# Altium project BMS.PrjPcb (part 1 of 2)
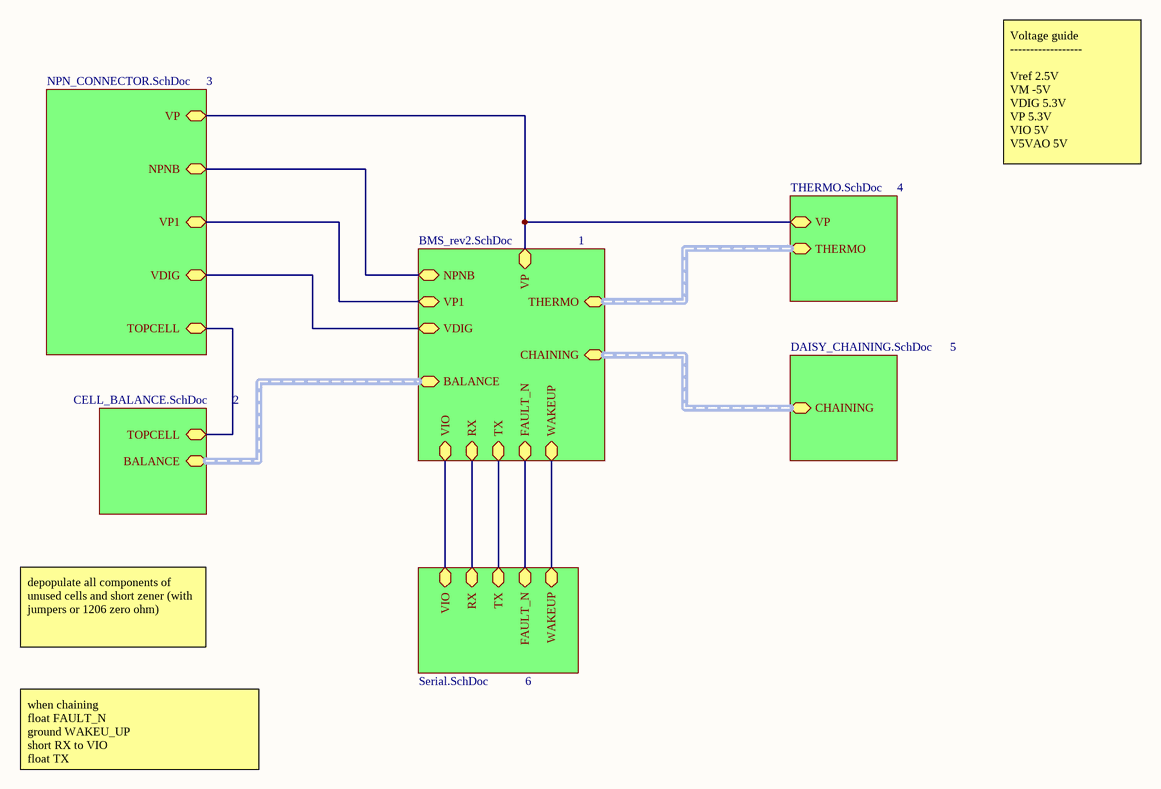
[diagram p0: BMS.SchDoc]
8 sheets, 234 parts. Net scope: hierarchical (ports join the sheet entries above them; power ports are global).
Board file: PCB_REV1.PcbDoc
Sheets:
  BMS.SchDoc
    1 = BMS_rev2.SchDoc
    2 = CELL_BALANCE.SchDoc
      4 = VSENSE_EQ.SchDoc
      3 = VSENSE_EQ.SchDoc
      2 = VSENSE_EQ.SchDoc
      1 = VSENSE_EQ.SchDoc
      5 = VSENSE_EQ.SchDoc
      6 = VSENSE_EQ.SchDoc
      7 = VSENSE_EQ.SchDoc
      8 = VSENSE_EQ.SchDoc
      12 = VSENSE_EQ.SchDoc
      11 = VSENSE_EQ.SchDoc
      10 = VSENSE_EQ.SchDoc
      9 = VSENSE_EQ.SchDoc
      13 = VSENSE_EQ.SchDoc
      14 = VSENSE_EQ.SchDoc
      15 = VSENSE_EQ.SchDoc
      16 = VSENSE_EQ.SchDoc
    5 = DAISY_CHAINING.SchDoc
    4 = THERMO.SchDoc
    3 = NPN_CONNECTOR.SchDoc
    6 = Serial.SchDoc

## Sheet BMS.SchDoc: BMS - AFE
size A4; DrawnBy: Jarod Krane; SheetNumber: 1; SheetTotal: 8

### Sub-sheets
1 = BMS_rev2.SchDoc: NPNB, VP, BALANCE (harness balance), THERMO, CHAINING, VDIG, VP1, VIO, RX, TX, FAULT_N, WAKEUP
2 = CELL_BALANCE.SchDoc: BALANCE, TOPCELL
3 = NPN_CONNECTOR.SchDoc: TOPCELL, NPNB, VP, VDIG, VP1
4 = THERMO.SchDoc: THERMO (harness thermo), VP
5 = DAISY_CHAINING.SchDoc: CHAINING (harness chaining)
6 = Serial.SchDoc: VIO, RX, TX, FAULT_N, WAKEUP

### Nets
FAULT_N: sheet 1/FAULT_N, sheet 6/FAULT_N
NPNB: sheet 1/NPNB, sheet 3/NPNB
RX: sheet 1/RX, sheet 6/RX
TOPCELL: sheet 2/TOPCELL, sheet 3/TOPCELL
TX: sheet 1/TX, sheet 6/TX
VDIG: sheet 1/VDIG, sheet 3/VDIG
VIO: sheet 1/VP1, sheet 1/VIO, sheet 3/VP1, sheet 6/VIO
VP: sheet 1/VP, sheet 4/VP, sheet 3/VP
WAKEUP: sheet 1/WAKEUP, sheet 6/WAKEUP

### Buses and harness runs
harness sheet 1/BALANCE = sheet 2/BALANCE
harness sheet 1/CHAINING = sheet 5/CHAINING
harness sheet 1/THERMO = sheet 4/THERMO

### Notes on the sheet
- Voltage guide
  ------------------
  Vref	2.5V
  VM	-5V
  VDIG	5.3V
  VP	5.3V
  VIO	5V
  V5VAO	5V
- depopulate all components of unused cells and short zener (with jumpers or 1206 zero ohm)
- when chaining
  float FAULT_N
  ground WAKEU_UP
  short RX to VIO
  float TX
  populate resistor connecting VIO to VP

## Sheet BMS_rev2.SchDoc: BMS - AFE
size A4; DrawnBy: Jarod Krane; SheetTotal: 8
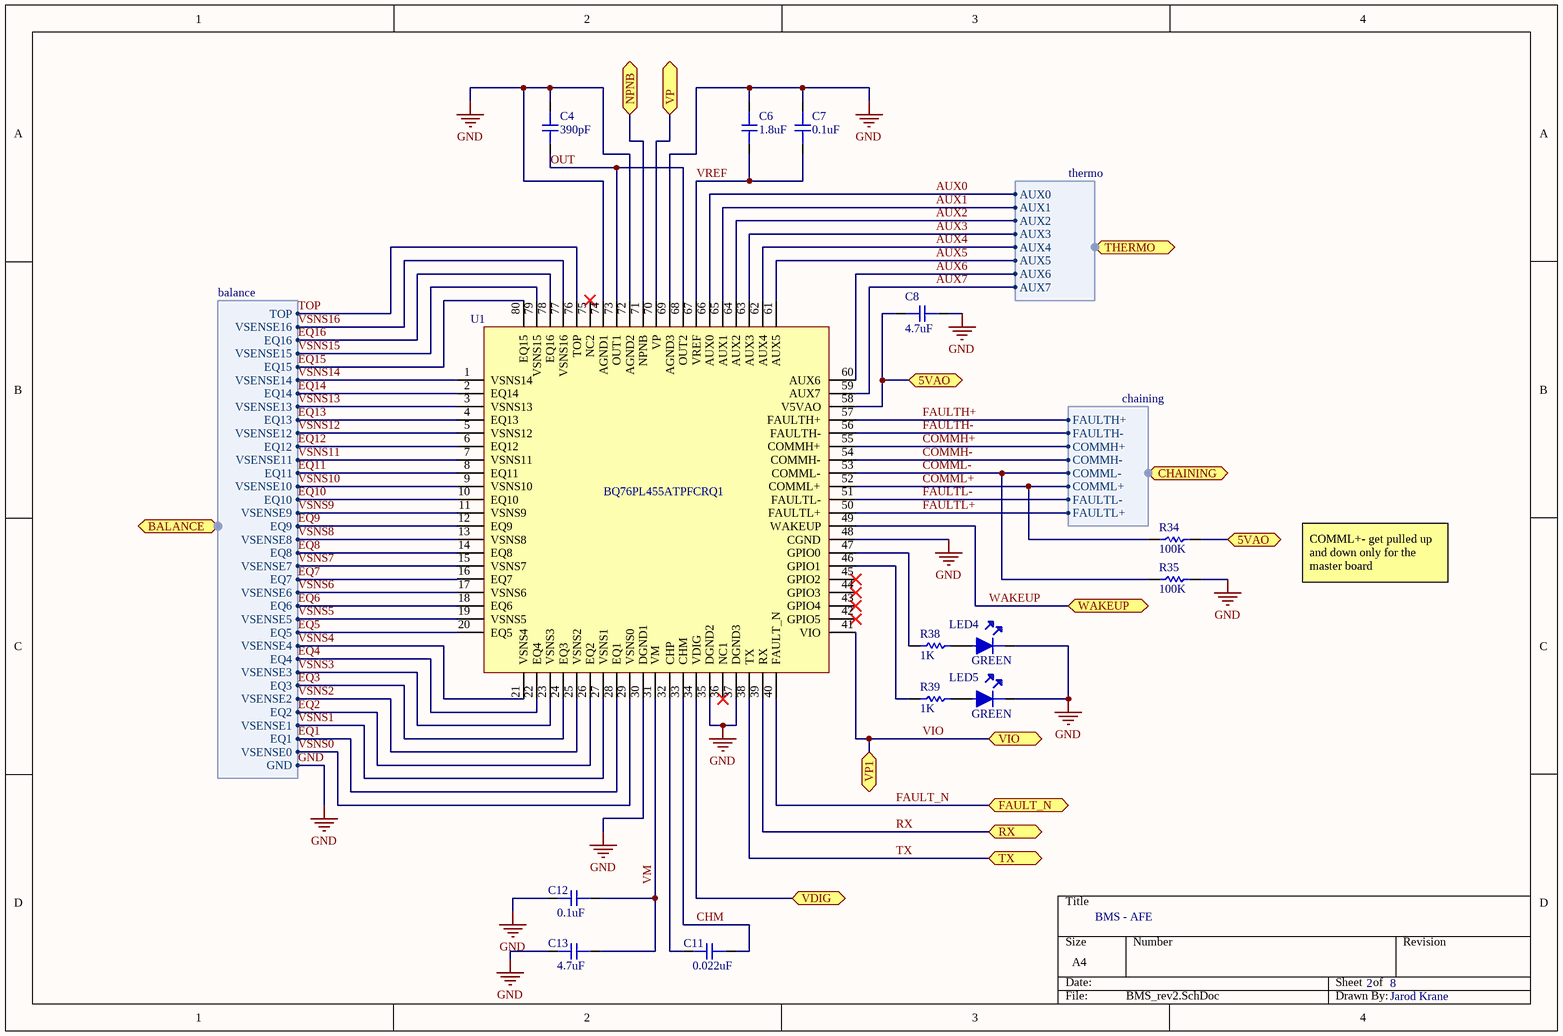
[diagram p1: BMS_rev2.SchDoc]

### Parts
C4  390pF  [0805 CAP]
C6  1.8uF  [1210 cap]
C7  0.1uF  [0603 CAP - duplicate]
C8  4.7uF  [0805 CAP]
C11  0.022uF  [0603 CAP - duplicate]
C12  0.1uF  [0603 CAP - duplicate]
C13  4.7uF  [0805 CAP]
LED4  GREEN  [LED2]
LED5  GREEN  [LED2]
R34  100K  [0603 RES]
R35  100K  [0603 RES]
R38  1K  [0603 RES]
R39  1K  [0603 RES]
U1  BQ76PL455ATPFCRQ1  [BQ76PL455A-Q1]

### Ports
5VAO, BALANCE (harness balance), CHAINING (harness chaining), FAULT_N, NPNB, RX, THERMO (harness thermo), TX, VDIG, VIO, VP, VP1, WAKEUP

### Harnesses
balance: TOP, VSENSE16, EQ16, VSENSE15, VSENSE13, EQ13, VSENSE12, EQ12, VSENSE11, EQ11, VSENSE10, EQ10, VSENSE9, EQ9, VSENSE8, EQ8, VSENSE7, EQ7, VSENSE6, EQ6, VSENSE5, EQ5, VSENSE4, EQ4, VSENSE3, EQ3, VSENSE2, EQ15, VSENSE14, EQ14, EQ2, VSENSE1, EQ1, VSENSE0, GND
chaining: FAULTH+, FAULTH-, COMMH+, COMMH-, COMML-, COMML+, FAULTL-, FAULTL+
thermo: AUX0, AUX1, AUX2, AUX3, AUX4, AUX5, AUX6, AUX7

### Nets
GND: C4.2 C6.2 C7.2 C8.2 C12.1 C13.1 LED4.2 LED5.2 R35.2 U1.30(DGND1) U1.35(DGND2) U1.37(DGND3) U1.48(CGND) U1.69(AGND3) U1.72(AGND2) U1.74(AGND1) ; port BALANCE.GND
AUX0: U1.66(AUX0) ; port THERMO.AUX0
AUX1: U1.65(AUX1) ; port THERMO.AUX1
AUX2: U1.64(AUX2) ; port THERMO.AUX2
AUX3: U1.63(AUX3) ; port THERMO.AUX3
AUX4: U1.62(AUX4) ; port THERMO.AUX4
AUX5: U1.61(AUX5) ; port THERMO.AUX5
AUX6: U1.60(AUX6) ; port THERMO.AUX6
AUX7: U1.59(AUX7) ; port THERMO.AUX7
CHM: C11.2 U1.33(CHM)
COMMH+: U1.55(COMMH+) ; port CHAINING.COMMH+
COMMH-: U1.54(COMMH-) ; port CHAINING.COMMH-
COMML+: R34.1 U1.52(COMML+) ; port CHAINING.COMML+
COMML-: R35.1 U1.53(COMML-) ; port CHAINING.COMML-
EQ1: U1.28(EQ1) ; port BALANCE.EQ1
EQ2: U1.26(EQ2) ; port BALANCE.EQ2
EQ3: U1.24(EQ3) ; port BALANCE.EQ3
EQ4: U1.22(EQ4) ; port BALANCE.EQ4
EQ5: U1.20(EQ5) ; port BALANCE.EQ5
EQ6: U1.18(EQ6) ; port BALANCE.EQ6
EQ7: U1.16(EQ7) ; port BALANCE.EQ7
EQ8: U1.14(EQ8) ; port BALANCE.EQ8
EQ9: U1.12(EQ9) ; port BALANCE.EQ9
EQ10: U1.10(EQ10) ; port BALANCE.EQ10
EQ11: U1.8(EQ11) ; port BALANCE.EQ11
EQ12: U1.6(EQ12) ; port BALANCE.EQ12
EQ13: U1.4(EQ13) ; port BALANCE.EQ13
EQ14: U1.2(EQ14) ; port BALANCE.EQ14
EQ15: U1.80(EQ15) ; port BALANCE.EQ15
EQ16: U1.78(EQ16) ; port BALANCE.EQ16
FAULT_N: U1.40(FAULT_N) ; port FAULT_N
FAULTH+: U1.57(FAULTH+) ; port CHAINING.FAULTH+
FAULTH-: U1.56(FAULTH-) ; port CHAINING.FAULTH-
FAULTL+: U1.50(FAULTL+) ; port CHAINING.FAULTL+
FAULTL-: U1.51(FAULTL-) ; port CHAINING.FAULTL-
NPNB: U1.71(NPNB) ; port NPNB
OUT: C4.1 U1.68(OUT2) U1.73(OUT1)
RX: U1.39(RX) ; port RX
TOP: U1.76(TOP) ; port BALANCE.TOP
TX: U1.38(TX) ; port TX
VDIG: U1.34(VDIG) ; port VDIG
VIO: U1.41(VIO) ; port VP1, port VIO
VM: C12.2 C13.2 U1.31(VM)
VP: U1.70(VP) ; port VP
VREF: C6.1 C7.1 U1.67(VREF)
VSNS0: U1.29(VSNS0) ; port BALANCE.VSENSE0
VSNS1: U1.27(VSNS1) ; port BALANCE.VSENSE1
VSNS2: U1.25(VSNS2) ; port BALANCE.VSENSE2
VSNS3: U1.23(VSNS3) ; port BALANCE.VSENSE3
VSNS4: U1.21(VSNS4) ; port BALANCE.VSENSE4
VSNS5: U1.19(VSNS5) ; port BALANCE.VSENSE5
VSNS6: U1.17(VSNS6) ; port BALANCE.VSENSE6
VSNS7: U1.15(VSNS7) ; port BALANCE.VSENSE7
VSNS8: U1.13(VSNS8) ; port BALANCE.VSENSE8
VSNS9: U1.11(VSNS9) ; port BALANCE.VSENSE9
VSNS10: U1.9(VSNS10) ; port BALANCE.VSENSE10
VSNS11: U1.7(VSNS11) ; port BALANCE.VSENSE11
VSNS12: U1.5(VSNS12) ; port BALANCE.VSENSE12
VSNS13: U1.3(VSNS13) ; port BALANCE.VSENSE13
VSNS14: U1.1(VSNS14) ; port BALANCE.VSENSE14
VSNS15: U1.79(VSNS15) ; port BALANCE.VSENSE15
VSNS16: U1.77(VSNS16) ; port BALANCE.VSENSE16
WAKEUP: U1.49(WAKEUP) ; port WAKEUP
NetC8_1: C8.1 R34.2 U1.58(V5VAO) ; port 5VAO
NetC11_1: C11.1 U1.32(CHP)
NetLED4_1: LED4.1 R38.2
NetLED5_1: LED5.1 R39.2
NetR38_1: R38.1 U1.47(GPIO0)
NetR39_1: R39.1 U1.46(GPIO1)

Not connected (* = marked no-connect by the designer): U1 36(NC1)* 42(GPIO5)* 43(GPIO4)* 44(GPIO3)* 45(GPIO2)* 75(NC2)*

### Notes on the sheet
- COMML+- get pulled up and down only for the master board
- 2

### Library data of the parts
C4 = 08055A391JAT2A: CAP CER 390PF 50V C0G/NP0 0805; Manufacturer: Kyocera AVX; Dielectric Material: Ceramic; Tolerance: 5%; Dielectric: C0G; Temperature Coefficient: 30ppm/°C; Supplier 1: Digi-Key; Manufacturer Part Number: 08055A391JAT2A; Stock 1: 18; Pricing 1: 1=0.22, 10=0.16, 100=0.075, 500=0.0526, 1000=0.0436 (USD); Mount: PCB,Surface Mount; Case/Package: 0805; Number of Pins: 2; Case Code (Imperial): 0805; Case Code (Metric): 2012; Contact Plating: Matte,Tin; Min Operating Temperature: -55°C; Max Operating Temperature: 125°C; Packaging: Tape and Reel; Capacitance: 390pF; Package Quantity: 1; Voltage Rating: 50V; Voltage Rating (DC): 50V; Termination: SMD/SMT; Voltage: 50V; Length: 2.01mm; Height: 0.94mm; Width: 1.25mm; Thickness: 0.037inch; Depth: 1.25mm; Radiation Hardening: No; REACH SVHC: No SVHC; Lead Free: Lead Free; Supplier Part Number 1: 478-1323-1-ND
C6 = C1210C185K3RACTU: CAP CER 1.8UF 25V X7R 1210; Manufacturer: KEMET; Dielectric Material: Ceramic; Tolerance: 10%; Dissipation Factor: 3.5%; Supplier 1: Digi-Key; Manufacturer Part Number: C1210C185K3RACTU; Stock 1: 3636; Pricing 1: 1=1.15, 10=0.876, 100=0.6267, 500=0.4852, 1000=0.4178 (USD); Mount: PCB,Surface Mount; Case/Package: 1210; Case Code (Metric): 3225; Case Code (Imperial): 1210; Min Operating Temperature: -55°C; Max Operating Temperature: 125°C; Package Quantity: 1; Capacitance: 1.8uF; Voltage Rating: 25V; Packaging: Tape and Reel; Voltage Rating (DC): 25V; Dielectric: X7R; Termination: SMD/SMT; Voltage: 25V; Length: 3.2mm; Height: 1.55mm; Width: 0.098inch; Thickness: 0.067inch; Depth: 2.5mm; REACH SVHC: No SVHC; Supplier Part Number 1: 399-3082-1-ND
C7 C12 = 06035C104KAZ2A: CAP CER 0.1UF 50V X7R 0603; Manufacturer: Kyocera AVX; Capacitance: 100nF; Tolerance: 10%; Temperature Coefficient: 30ppm/°C; Supplier 1: Digi-Key; Manufacturer Part Number: 06035C104KAZ2A; Stock 1: 40000; Pricing 1: 1=0.23, 10=0.161, 100=0.0756, 500=0.053, 1000=0.0439 (USD); Mount: PCB,Surface Mount; Case/Package: 0603; Number of Pins: 2; Case Code (Metric): 1608; Case Code (Imperial): 0603; Contact Plating: Matte,Tin; Min Operating Temperature: -55°C; Max Operating Temperature: 125°C; Package Quantity: 1; Voltage Rating: 50V; Packaging: Tape and Reel; Voltage Rating (DC): 50V; Dielectric: X7R; Termination: SMD/SMT; Voltage: 50V; Features: Soft Termination; Length: 1.6mm; Height: 0.94mm; Width: 0.032inch; Thickness: 0.035inch; Depth: 0.81mm; Radiation Hardening: No; REACH SVHC: No SVHC; Lead Free: Lead Free; Supplier Part Number 1: 478-3540-1-ND
C8 C13 = CL21B475KOFNFNE: CAP CER 4.7UF 16V X7R 0805; Manufacturer: Samsung; Tolerance: 10%; Supplier 1: Digi-Key; Manufacturer Part Number: CL21B475KOFNFNE; Stock 1: 20000; Pricing 1: 1=0.3, 10=0.208, 100=0.1181, 500=0.0833, 1000=0.0729 (USD); Mount: Surface Mount; Case/Package: 0805; Case Code (Metric): 2012; Case Code (Imperial): 0805; Min Operating Temperature: -55°C; Max Operating Temperature: 125°C; Package Quantity: 1; Packaging: Tape and Reel; Capacitance: 4.7uF; Voltage Rating: 16V; Dielectric: X7R; Length: 0.079inch; Height: 1.25mm; Width: 0.049inch; Thickness: 0.053inch; Depth: 1.25mm; Radiation Hardening: No; Supplier Part Number 1: 1276-2970-1-ND
C11 = C1608X7R1H223K080AA: CAP CER 0.022UF 50V X7R 0603; Manufacturer: TDK; Dielectric Material: Ceramic; Capacitance: 22nF; Tolerance: 10%; Supplier 1: Digi-Key; Manufacturer Part Number: C1608X7R1H223K080AA; Stock 1: 3; Pricing 1: 1=0.1, 10=0.074, 100=0.0331, 500=0.0237, 1000=0.0186 (USD); Mount: Surface Mount; Case/Package: 0603; Number of Pins: 2; Weight: 7.1E-05oz; Case Code (Metric): 1608; Case Code (Imperial): 0603; Min Operating Temperature: -55°C; Max Operating Temperature: 125°C; Package Quantity: 1; Voltage Rating: 50V; Packaging: Tape and Reel; Voltage Rating (DC): 50V; Dielectric: X7R; Termination: SMD/SMT; Composition: Ceramic; Voltage: 50V; Length: 1.6mm; Height: 0.8mm; Width: 0.031inch; Thickness: 0.037inch; Depth: 0.8mm; Radiation Hardening: No; REACH SVHC: No SVHC; Lead Free: Lead Free; Supplier Part Number 1: 445-1312-1-ND
LED4 LED5 = 150060VS75000: LED GREEN CLEAR 0603 SMD; Manufacturer: Wurth Electronics; Luminous Intensity: 40mcd; Viewing Angle: 140°; Forward Voltage: 2V; Wavelength: 570nm; Lens Style: Clear,Rectangular; Forward Current: 30mA; Test Current: 20mA; Supplier 1: Digi-Key; Manufacturer Part Number: 150060VS75000; Stock 1: 219425; Pricing 1: 1=0.14, 50=0.129, 100=0.11, 500=0.095 (USD); Mount: Surface Mount; Case/Package: 0603; Number of Pins: 2; Colour: Green; Case Code (Metric): 1608; Case Code (Imperial): 0603; Min Operating Temperature: -40°C; Max Operating Temperature: 85°C; Package Quantity: 1; Packaging: Tape and Reel; Dominant Wavelength: 570nm; Length: 1.6mm; Height: 0.7mm; Width: 0.8mm; REACH SVHC: Unknown; ComponentLink1URL: http://www.farnell.com/datasheets/1911347.pdf; ComponentLink1Description: http://www.farnell.com/datasheets/1911347.pdf; ComponentLink2URL: https://katalog.we-online.de/led/datasheet/150060VS75000.pdf; ComponentLink2Description: https://katalog.we-online.de/led/datasheet/150060VS75000.pdf; ComponentLink3URL: https://www.distrelec.biz/Web/Downloads/_t/ds/150060VS75000_eng_tds.pdf?mime=application%2Fpdf; ComponentLink3Description: https://www.distrelec.biz/Web/Downloads/_t/ds/150060VS75000_eng_tds.pdf?mime=application%2Fpdf; ComponentLink4URL: http://www.produktinfo.conrad.com/datenblaetter/750000-774999/759431-da-01-en-CHIPLED_0603_W_KL_H_GRUEN_150060VS7500.pdf; ComponentLink4Description: http://www.produktinfo.conrad.com/datenblaetter/750000-774999/759431-da-01-en-CHIPLED_0603_W_KL_H_GRUEN_150060VS7500.pdf; Supplier Part Number 1: 732-4980-1-ND
R34 R35 = ERJ-3EKF1003V: RES SMD 100K OHM 1% 1/10W 0603; Manufacturer: Panasonic; Manufacturer Part Number: ERJ3EKF-1003V; Resistance: 100kR; Power Rating: 100mW; Voltage Rating: 75V; Temperature Coefficient: 100ppm/°C; Supplier 1: Digi-Key; Stock 1: 10349154; Pricing 1: 1=0.1, 10=0.064, 100=0.0261, 1000=0.0117, 2500=0.0102 (USD); Case/Package: 0603; Number of Pins: 2; Case Code (Metric): 1608; Case Code (Imperial): 0603; Contact Plating: Tin; Min Operating Temperature: -55°C; Max Operating Temperature: 155°C; Tolerance: 1%; Packaging: Tape and Reel; Composition: Thick Film; Military Standard: Not; Voltage Rating (DC): 75V; Length: 1.6mm; Depth: 0.8mm; Width: 800um; Radiation Hardening: No; REACH SVHC: No SVHC; Lead Free: Lead Free; Supplier Part Number 1: P100KHCT-ND; Supplier 2: Digi-Key; Stock 2: 4435882; Pricing 2: 1=0.1, 10=0.024, 100=0.0097, 1000=0.0044, 2500=0.0038 (USD); Mount: Surface Mount; Package Quantity: 1; Number of Terminations: 2; Termination: SMD/SMT; Max Power Dissipation: 100mW; Features: Moisture Resistant; Height: 0.022inch; ComponentLink1URL: https://www.verical.com/server-webapp/html/getDatasheet?partID=323805&src-supplier=Verical; ComponentLink1Description: https://www.verical.com/server-webapp/html/getDatasheet?partID=323805&src-supplier=Verical; ComponentLink2URL: http://www.yageo.com/documents/recent/PYu-RC_Group_51_RoHS_L_10.pdf?src-supplier=Digi-Key; ComponentLink2Description: http://www.yageo.com/documents/recent/PYu-RC_Group_51_RoHS_L_10.pdf?src-supplier=Digi-Key; ComponentLink3URL: http://www.yageo.com/documents/recent/PYu-RC_Group_51_RoHS_L_9.pdf?src-supplier=Digi-Key; ComponentLink3Description: http://www.yageo.com/documents/recent/PYu-RC_Group_51_RoHS_L_9.pdf?src-supplier=Digi-Key; Supplier Part Number 2: 311-49.9KHRCT-ND
R38 R39 = CRCW06031K00FKEA: RES SMD 1K OHM 1% 1/10W 0603; Manufacturer: Vishay Dale; Resistance: 1kR; Power Rating: 100mW; Voltage Rating: 75V; Temperature Coefficient: 100ppm/°C; Supplier 1: Digi-Key; Manufacturer Part Number: CRCW06031K00FKEA; Stock 1: 3823619; Pricing 1: 1=0.1, 10=0.042, 100=0.017, 1000=0.0076, 2500=0.0066 (USD); Mount: Surface Mount; Case/Package: 0603; Number of Pins: 2; Weight: 7.1E-05oz; Case Code (Metric): 1608; Case Code (Imperial): 0603; Contact Plating: Tin; Min Operating Temperature: -55°C; Max Operating Temperature: 155°C; Composition: Thick Film; Tolerance: 1%; Packaging: Tape and Reel; Package Quantity: 10; Number of Terminations: 2; Termination: SMD/SMT; Military Standard: Not; Max Power Dissipation: 100mW; Voltage Rating (DC): 75V; Features: Automotive AEC-Q200; Length: 1.55mm; Height: 0.45mm; Width: 0.033inch; Depth: 0.85mm; Radiation Hardening: No; REACH SVHC: Unknown; Lead Free: Lead Free; Supplier Part Number 1: 541-1.00KHCT-ND
U1 = BQ76PL455ATPFCRQ1: IC BATT MONITOR/PROTECT 80TQFP; Manufacturer: Texas Instruments; Interface: UART; Fault Protection: Over/Under Voltage; Operating Supply Voltage: 22V; Supplier 1: Digi-Key; Manufacturer Part Number: BQ76PL455ATPFCRQ1; Stock 1: 0; Pricing 1: 1=19.03, 10=17.486, 100=14.7676, 500=13.1368 (USD); Mount: Surface Mount; Case/Package: TQFP; Number of Pins: 80; Min Operating Temperature: -40°C; Max Operating Temperature: 105°C; Packaging: Tape and Reel; Lead Free: Lead Free; Supplier Part Number 1: 296-44049-1-ND

## Sheet CELL_BALANCE.SchDoc: BMS - AFE
size A4; DrawnBy: Jarod Krane; SheetNumber: 3; SheetTotal: 8
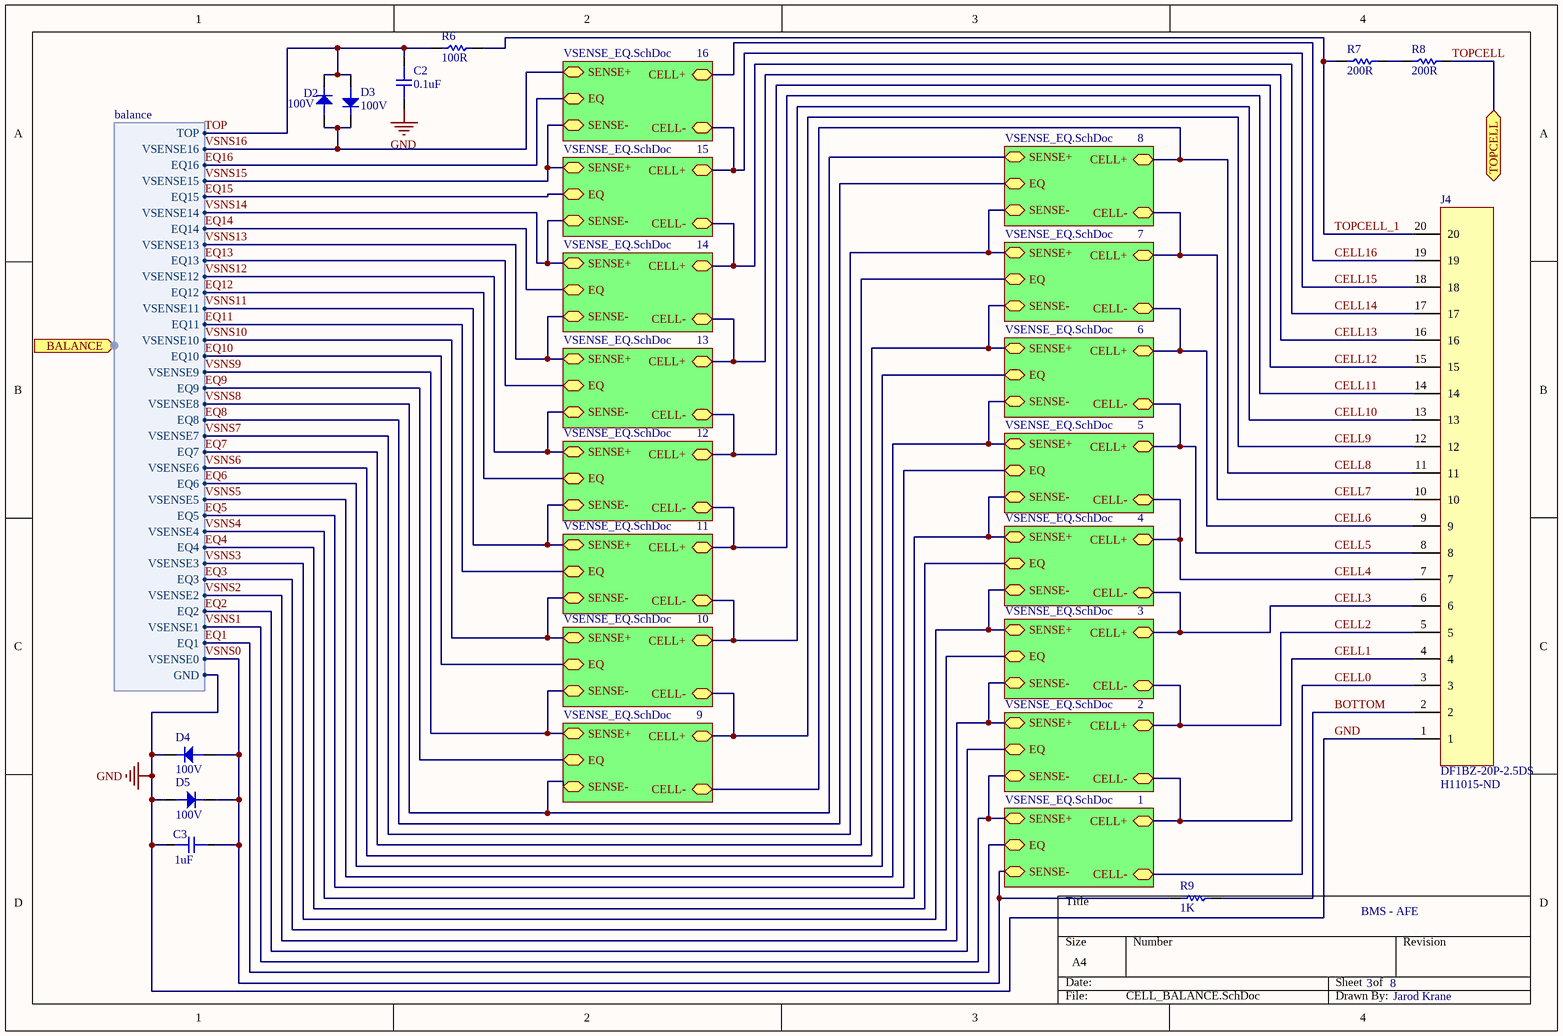
[diagram p2: CELL_BALANCE.SchDoc]

### Parts
C2  0.1uF  [1210 cap]
C3  1uF  [0603 CAP - duplicate]
D2  100V  [DIODE BtoB]
D3  100V  [DIODE BtoB]
D4  100V  [DIODE BtoB]
D5  100V  [DIODE BtoB]
J4  DF1BZ-20P-2.5DS  Supplier Part Number 1: H11015-ND  [PCBComponent_1]
R6  100R  [1206 RES]
R7  200R  [2512 RES]
R8  200R  [2512 RES]
R9  1K  [0603 RES]

### Sub-sheets
1 = VSENSE_EQ.SchDoc: SENSE+, CELL+, SENSE-, CELL-, EQ
2 = VSENSE_EQ.SchDoc: SENSE+, CELL+, SENSE-, CELL-, EQ
3 = VSENSE_EQ.SchDoc: SENSE+, CELL+, SENSE-, CELL-, EQ
4 = VSENSE_EQ.SchDoc: SENSE+, CELL+, SENSE-, CELL-, EQ
5 = VSENSE_EQ.SchDoc: SENSE+, CELL+, SENSE-, CELL-, EQ
6 = VSENSE_EQ.SchDoc: SENSE+, CELL+, SENSE-, CELL-, EQ
7 = VSENSE_EQ.SchDoc: SENSE+, CELL+, SENSE-, CELL-, EQ
8 = VSENSE_EQ.SchDoc: SENSE+, CELL+, SENSE-, CELL-, EQ
9 = VSENSE_EQ.SchDoc: SENSE+, CELL+, SENSE-, CELL-, EQ
10 = VSENSE_EQ.SchDoc: SENSE+, CELL+, SENSE-, CELL-, EQ
11 = VSENSE_EQ.SchDoc: SENSE+, CELL+, SENSE-, CELL-, EQ
12 = VSENSE_EQ.SchDoc: SENSE+, CELL+, SENSE-, CELL-, EQ
13 = VSENSE_EQ.SchDoc: SENSE+, CELL+, SENSE-, CELL-, EQ
14 = VSENSE_EQ.SchDoc: SENSE+, CELL+, SENSE-, CELL-, EQ
15 = VSENSE_EQ.SchDoc: SENSE+, CELL+, SENSE-, CELL-, EQ
16 = VSENSE_EQ.SchDoc: SENSE+, CELL+, SENSE-, CELL-, EQ

### Ports
BALANCE (harness balance), TOPCELL

### Harnesses
balance: GND, VSENSE0, EQ1, VSENSE1, EQ2, VSENSE2, EQ3, VSENSE3, EQ4, VSENSE4, EQ5, VSENSE5, EQ6, VSENSE6, EQ7, VSENSE7, EQ8, VSENSE8, EQ9, VSENSE9, EQ10, VSENSE10, EQ11, VSENSE11, EQ12, VSENSE12, EQ13, VSENSE13, EQ14, VSENSE14, EQ15, VSENSE15, EQ16, VSENSE16, TOP

### Nets
GND: C2.1 C3.1 D4.2 D5.1 J4.1 ; port BALANCE.GND
BOTTOM: J4.2 R9.2
CELL0: J4.3 ; sheet 1/CELL-
CELL1: J4.4 ; sheet 2/CELL-, sheet 1/CELL+
CELL2: J4.5 ; sheet 3/CELL-, sheet 2/CELL+
CELL3: J4.6 ; sheet 4/CELL-, sheet 3/CELL+
CELL4: J4.7 ; sheet 4/CELL+, sheet 5/CELL-
CELL5: J4.8 ; sheet 5/CELL+, sheet 6/CELL-
CELL6: J4.9 ; sheet 6/CELL+, sheet 7/CELL-
CELL7: J4.10 ; sheet 7/CELL+, sheet 8/CELL-
CELL8: J4.11 ; sheet 8/CELL+, sheet 9/CELL-
CELL9: J4.12 ; sheet 10/CELL-, sheet 9/CELL+
CELL10: J4.13 ; sheet 11/CELL-, sheet 10/CELL+
CELL11: J4.14 ; sheet 12/CELL-, sheet 11/CELL+
CELL12: J4.15 ; sheet 12/CELL+, sheet 13/CELL-
CELL13: J4.16 ; sheet 13/CELL+, sheet 14/CELL-
CELL14: J4.17 ; sheet 14/CELL+, sheet 15/CELL-
CELL15: J4.18 ; sheet 15/CELL+, sheet 16/CELL-
CELL16: J4.19 ; sheet 16/CELL+
EQ1: sheet 1/EQ, port BALANCE.EQ1
EQ2: sheet 2/EQ, port BALANCE.EQ2
EQ3: sheet 3/EQ, port BALANCE.EQ3
EQ4: sheet 4/EQ, port BALANCE.EQ4
EQ5: sheet 5/EQ, port BALANCE.EQ5
EQ6: sheet 6/EQ, port BALANCE.EQ6
EQ7: sheet 7/EQ, port BALANCE.EQ7
EQ8: sheet 8/EQ, port BALANCE.EQ8
EQ9: sheet 9/EQ, port BALANCE.EQ9
EQ10: sheet 10/EQ, port BALANCE.EQ10
EQ11: sheet 11/EQ, port BALANCE.EQ11
EQ12: sheet 12/EQ, port BALANCE.EQ12
EQ13: sheet 13/EQ, port BALANCE.EQ13
EQ14: sheet 14/EQ, port BALANCE.EQ14
EQ15: sheet 15/EQ, port BALANCE.EQ15
EQ16: sheet 16/EQ, port BALANCE.EQ16
TOP: C2.2 D2.2 D3.1 R6.1 ; port BALANCE.TOP
TOPCELL: R8.2 ; port TOPCELL
TOPCELL_1: J4.20 R6.2 R7.1
VSNS0: C3.2 D4.1 D5.2 R9.1 ; sheet 1/SENSE-, port BALANCE.VSENSE0
VSNS1: sheet 2/SENSE-, sheet 1/SENSE+, port BALANCE.VSENSE1
VSNS2: sheet 3/SENSE-, sheet 2/SENSE+, port BALANCE.VSENSE2
VSNS3: sheet 4/SENSE-, sheet 3/SENSE+, port BALANCE.VSENSE3
VSNS4: sheet 4/SENSE+, sheet 5/SENSE-, port BALANCE.VSENSE4
VSNS5: sheet 5/SENSE+, sheet 6/SENSE-, port BALANCE.VSENSE5
VSNS6: sheet 6/SENSE+, sheet 7/SENSE-, port BALANCE.VSENSE6
VSNS7: sheet 7/SENSE+, sheet 8/SENSE-, port BALANCE.VSENSE7
VSNS8: sheet 8/SENSE+, sheet 9/SENSE-, port BALANCE.VSENSE8
VSNS9: sheet 10/SENSE-, sheet 9/SENSE+, port BALANCE.VSENSE9
VSNS10: sheet 11/SENSE-, sheet 10/SENSE+, port BALANCE.VSENSE10
VSNS11: sheet 12/SENSE-, sheet 11/SENSE+, port BALANCE.VSENSE11
VSNS12: sheet 12/SENSE+, sheet 13/SENSE-, port BALANCE.VSENSE12
VSNS13: sheet 13/SENSE+, sheet 14/SENSE-, port BALANCE.VSENSE13
VSNS14: sheet 14/SENSE+, sheet 15/SENSE-, port BALANCE.VSENSE14
VSNS15: sheet 15/SENSE+, sheet 16/SENSE-, port BALANCE.VSENSE15
VSNS16: D2.1 D3.2 ; sheet 16/SENSE+, port BALANCE.VSENSE16
NetR7_2: R7.2 R8.1

### Library data of the parts
C2 = C1210C104KARACTU: CAP CER 0.1UF 250V X7R 1210; Manufacturer: KEMET; Dielectric Material: Ceramic; Capacitance: 100nF; Tolerance: 10%; Dissipation Factor: 2.5%; Supplier 1: Digi-Key; Manufacturer Part Number: C1210C104KARACTU; Stock 1: 3355; Pricing 1: 1=0.68, 10=0.479, 100=0.3156, 500=0.2338, 1000=0.1987 (USD); Mount: PCB,Surface Mount; Case/Package: 1210; Number of Pins: 2; Case Code (Imperial): 1210; Case Code (Metric): 3225; Min Operating Temperature: -55°C; Max Operating Temperature: 125°C; Voltage Rating (DC): 250V; Voltage Rating: 250V; Packaging: Tape and Reel; Package Quantity: 1; Dielectric: X7R; Termination: SMD/SMT; Voltage: 250V; Length: 3.2mm; Height: 1.5mm; Width: 2.5mm; Thickness: 0.055inch; Depth: 2.5mm; REACH SVHC: No SVHC; Supplier Part Number 1: 399-4676-1-ND
C3 = C1608X7R1C105K080AC: CAP CER 1UF 16V X7R 0603; Manufacturer: TDK; Dielectric Material: Ceramic; Tolerance: 10%; Supplier 1: Digi-Key; Manufacturer Part Number: C1608X7R1C105K080AC; Stock 1: 0; Pricing 1: 1=0.12, 10=0.087, 100=0.0387, 500=0.0277, 1000=0.0217 (USD); Mount: Surface Mount; Case/Package: 0603; Weight: 7.1E-05oz; Case Code (Metric): 1608; Case Code (Imperial): 0603; Min Operating Temperature: -55°C; Max Operating Temperature: 125°C; Packaging: Tape and Reel; Package Quantity: 1; Capacitance: 1uF; Voltage Rating: 16V; Voltage Rating (DC): 16V; Dielectric: X7R; Termination: SMD/SMT; Composition: Ceramic; Voltage: 16V; Length: 1.6mm; Height: 0.8mm; Width: 0.031inch; Thickness: 0.037inch; Depth: 0.8mm; Radiation Hardening: No; REACH SVHC: No SVHC; Lead Free: Lead Free; Supplier Part Number 1: 445-1604-1-ND
D2-D5 = 1N4148W-7-F: DIODE GEN PURP 100V 300MA SOD123; Manufacturer: Diodes; Max Surge Current: 2A; Forward Current: 150mA; Peak Reverse Current: 1uA; Recovery Time: 4ns; Forward Voltage: 1.25V; Power Dissipation: 400mW; Element Configuration: Single; Polarity: Standard; Voltage Rating (DC): 75V; Capacitance: 2pF; Current: 15A; Supplier 1: Digi-Key; Manufacturer Part Number: 1N4148W-7-F; Stock 1: 0; Pricing 1: 1=0.18, 10=0.164, 100=0.0891, 500=0.0548, 1000=0.0374 (USD); Mount: Surface Mount; Number of Pins: 2; Weight: 0.000353oz; Contact Plating: Matte,Tin; Min Operating Temperature: -65°C; Max Operating Temperature: 150°C; Package Quantity: 3000; Packaging: Tape and Reel; Average Rectified Current: 300mA; Reverse Recovery Time: 4ns; Max Repetitive Reverse Voltage (Vrrm): 100V; Peak Non-Repetitive Surge Current: 2A; Power Rating: 400mW; Max Reverse Voltage (DC): 100V; Max Forward Surge Current (Ifsm): 2A; Current Rating: 150mA; Output Current: 150mA; Voltage: 100V; Length: 2.85mm; Height: 1.25mm; Width: 1.7mm; Radiation Hardening: No; Lead Free: Lead Free; REACH SVHC: No SVHC; Supplier Part Number 1: 1N4148W-FDICT-ND
J4 = DF1BZ-20P-2.5DS: CONN HEADER 20POS 2.5MM R/A TIN; Manufacturer: Hirose; Number of Positions: 20; Gender: Male; Connector Type: Male Pin; Pitch: 0.098inch; Supplier 1: Digi-Key; Manufacturer Part Number: DF1BZ-20P-2.5DS; Stock 1: 76; Pricing 1: 1=0.87, 10=0.765, 100=0.66, 500=0.54, 1000=0.48 (USD); Mount: Through Hole; Contact Plating: Tin; Colour: White; Housing Colour: White; Package Quantity: 100; Packaging: Bulk; Number of Rows: 1; Termination: Solder; Number of Contacts: 20; Contact Mating Length: 0.177inch; Lead Free: Lead Free
R6 = ERJ-8ENF1000V: RES SMD 100 OHM 1% 1/4W 1206; Manufacturer: Panasonic; Power Rating: 250mW; Voltage Rating: 200V; Temperature Coefficient: 100ppm/°C; Supplier 1: Digi-Key; Manufacturer Part Number: ERJ-8ENF1000V; Stock 1: 474856; Pricing 1: 1=0.11, 10=0.1, 100=0.0385, 1000=0.017, 2500=0.0146 (USD); Mount: Surface Mount; Case/Package: 1206; Number of Pins: 2; Case Code (Metric): 3216; Case Code (Imperial): 1206; Contact Plating: Tin; Min Operating Temperature: -55°C; Max Operating Temperature: 155°C; Resistance: 100R; Tolerance: 1%; Packaging: Tape and Reel; Package Quantity: 1; Composition: Thick Film; Number of Terminations: 2; Termination: SMD/SMT; Military Standard: Not; Max Power Dissipation: 250mW; Voltage Rating (DC): 200V; Features: Automotive AEC-Q200; Working Voltage: 200V; Length: 3.2mm; Height: 0.6mm; Width: 0.063inch; Depth: 1.6mm; Radiation Hardening: No; REACH SVHC: No SVHC; Lead Free: Lead Free; Supplier Part Number 1: P100FCT-ND
R7 R8 = CRCW2512200RJNEG: RES SMD 200 OHM 5% 1W 2512; Manufacturer: Vishay Dale; Voltage Rating: 500V; Temperature Coefficient: 200ppm/°C; Supplier 1: Digi-Key; Manufacturer Part Number: CRCW2512200RJNEG; Stock 1: 0; Pricing 1: 1=0.39, 10=0.333, 100=0.1301, 1000=0.0545 (USD); Mount: Surface Mount; Case/Package: 2512; Number of Pins: 2; Weight: 0.001429oz; Case Code (Metric): 6432; Case Code (Imperial): 2512; Contact Plating: Tin; Min Operating Temperature: -55°C; Max Operating Temperature: 155°C; Resistance: 200R; Tolerance: 5%; Packaging: Tape and Reel; Power Rating: 1W; Package Quantity: 2000; Composition: Thick Film; Number of Terminations: 2; Termination: SMD/SMT; Military Standard: Not; Max Power Dissipation: 1W; Voltage Rating (DC): 500V; Working Voltage: 500V; Features: Automotive AEC-Q200; Length: 6.3mm; Height: 0.6mm; Width: 0.124inch; Depth: 3.15mm; Radiation Hardening: No; REACH SVHC: Unknown; Lead Free: Lead Free; Supplier Part Number 1: 541-200XCT-ND
R9 = CRCW06031K00FKEA: as R38 on sheet BMS_rev2; Supplier 1: Digi-Key; Manufacturer Part Number: CRCW06031K00FKEA; Stock 1: 3823619; Pricing 1: 1=0.1, 10=0.042, 100=0.017, 1000=0.0076, 2500=0.0066 (USD); Mount: Surface Mount; Case/Package: 0603; Number of Pins: 2; Weight: 7.1E-05oz; Case Code (Metric): 1608; Case Code (Imperial): 0603; Contact Plating: Tin; Min Operating Temperature: -55°C; Max Operating Temperature: 155°C; Composition: Thick Film; Tolerance: 1%; Packaging: Tape and Reel; Package Quantity: 10; Number of Terminations: 2; Termination: SMD/SMT; Military Standard: Not; Max Power Dissipation: 100mW; Voltage Rating (DC): 75V; Features: Automotive AEC-Q200; Length: 1.55mm; Height: 0.45mm; Width: 0.033inch; Depth: 0.85mm; Radiation Hardening: No; REACH SVHC: Unknown; Lead Free: Lead Free; Supplier Part Number 1: 541-1.00KHCT-ND

## Sheet VSENSE_EQ.SchDoc: BMS - AFE
size A4; DrawnBy: Jarod Krane; SheetNumber: 4; SheetTotal: 8
Used 16 times, as channels 2/4, 2/3, 2/2, 2/1, 2/5, 2/6, 2/7, 2/8, 2/12, 2/11, 2/10, 2/9, 2/13, 2/14, 2/15, 2/16. Parts and nets are listed once, with the designators drawn on the sheet.
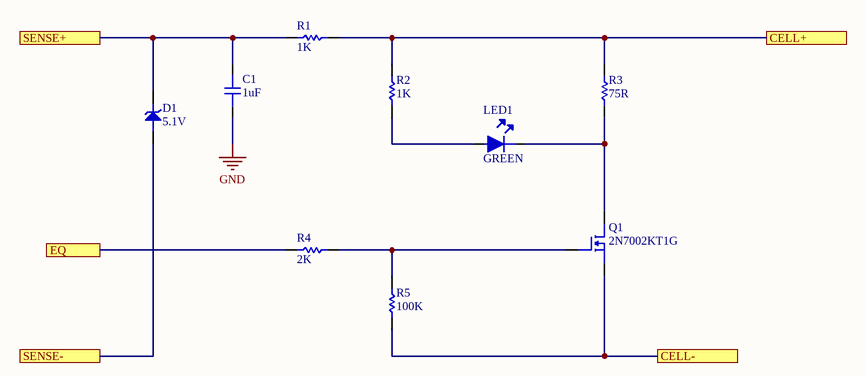
[diagram p3: VSENSE_EQ.SchDoc]

### Parts
C1  1uF  [0805 CAP]
D1  5.1V  [ZENER DIODE]
LED1  GREEN  [LED2]
Q1  2N7002KT1G  [N-MOSFET]
R1  1K  [0603 RES]
R2  1K  [0603 RES]
R3  75R  [2512 RES]
R4  2K  [0603 RES]
R5  100K  [0603 RES]

### Ports
CELL+, CELL-, EQ, SENSE+, SENSE-

### Nets
GND: C1.1
CELL+: R1.2 R2.2 R3.1 ; port CELL+
CELL-: Q1.2 R5.1 ; port CELL-
EQ: R4.1 ; port EQ
SENSE+: C1.2 D1.2 R1.1 ; port SENSE+
SENSE-: D1.1 ; port SENSE-
NetLED1_1: LED1.1 R2.1
NetLED1_2: LED1.2 Q1.3 R3.2
NetQ1_1: Q1.1 R4.2 R5.2

### Channels
2/4: designators end in _1; ports CELL+=CELL4 CELL-=CELL3 EQ=EQ4 SENSE+=VSNS4 SENSE-=VSNS3
2/3: designators end in _2; ports CELL+=CELL3 CELL-=CELL2 EQ=EQ3 SENSE+=VSNS3 SENSE-=VSNS2
2/2: designators end in _3; ports CELL+=CELL2 CELL-=CELL1 EQ=EQ2 SENSE+=VSNS2 SENSE-=VSNS1
2/1: designators end in _4; ports CELL+=CELL1 CELL-=CELL0 EQ=EQ1 SENSE+=VSNS1 SENSE-=VSNS0
2/5: designators end in _5; ports CELL+=CELL5 CELL-=CELL4 EQ=EQ5 SENSE+=VSNS5 SENSE-=VSNS4
2/6: designators end in _6; ports CELL+=CELL6 CELL-=CELL5 EQ=EQ6 SENSE+=VSNS6 SENSE-=VSNS5
2/7: designators end in _7; ports CELL+=CELL7 CELL-=CELL6 EQ=EQ7 SENSE+=VSNS7 SENSE-=VSNS6
2/8: designators end in _8; ports CELL+=CELL8 CELL-=CELL7 EQ=EQ8 SENSE+=VSNS8 SENSE-=VSNS7
2/12: designators end in _9; ports CELL+=CELL12 CELL-=CELL11 EQ=EQ12 SENSE+=VSNS12 SENSE-=VSNS11
2/11: designators end in _10; ports CELL+=CELL11 CELL-=CELL10 EQ=EQ11 SENSE+=VSNS11 SENSE-=VSNS10
2/10: designators end in _11; ports CELL+=CELL10 CELL-=CELL9 EQ=EQ10 SENSE+=VSNS10 SENSE-=VSNS9
2/9: designators end in _12; ports CELL+=CELL9 CELL-=CELL8 EQ=EQ9 SENSE+=VSNS9 SENSE-=VSNS8
2/13: designators end in _13; ports CELL+=CELL13 CELL-=CELL12 EQ=EQ13 SENSE+=VSNS13 SENSE-=VSNS12
2/14: designators end in _14; ports CELL+=CELL14 CELL-=CELL13 EQ=EQ14 SENSE+=VSNS14 SENSE-=VSNS13
2/15: designators end in _15; ports CELL+=CELL15 CELL-=CELL14 EQ=EQ15 SENSE+=VSNS15 SENSE-=VSNS14
2/16: designators end in _16; ports CELL+=CELL16 CELL-=CELL15 EQ=EQ16 SENSE+=VSNS16 SENSE-=VSNS15

### Library data of the parts
C1 = C2012X7S2A105K125AE: CAP CER 1UF 100V X7S 0805; Manufacturer: TDK; Tolerance: 10%; Supplier 1: Digi-Key; Manufacturer Part Number: C2012X7S2A105K125AE; Stock 1: 20000; Pricing 1: 1=0.5, 10=0.356, 100=0.2347, 500=0.1739, 1000=0.1478 (USD); Mount: Surface Mount; Case/Package: 0805; Case Code (Metric): 2012; Case Code (Imperial): 0805; Min Operating Temperature: -55°C; Max Operating Temperature: 125°C; Capacitance: 1uF; Voltage Rating: 100V; Packaging: Tape and Reel; Termination: SMD/SMT; Package Quantity: 1; Voltage Rating (DC): 100V; Dielectric: X7S; Composition: Ceramic; Features: Soft Termination; Length: 2mm; Height: 1.25mm; Width: 0.05inch; Thickness: 0.049inch; Depth: 1.25mm; Lead Free: Lead Free; ComponentLink1URL: https://product.tdk.com/info/en/catalog/spec/mlccspec_commercial_soft_en.pdf; ComponentLink1Description: https://product.tdk.com/info/en/catalog/spec/mlccspec_commercial_soft_en.pdf; ComponentLink2URL: http://www.mouser.com/ds/2/400/lcc_commercial_soft_en-520032.pdf; ComponentLink2Description: http://www.mouser.com/ds/2/400/lcc_commercial_soft_en-520032.pdf; Supplier Part Number 1: 445-8887-1-ND
D1 = MMSZ4689-TP: DIODE ZENER 5.1V 500MW SOD123; Manufacturer: MCC; Tolerance: 5%; Max Reverse Leakage Current: 10uA; Test Current: 50uA; Element Configuration: Single; Supplier 1: Digi-Key; Manufacturer Part Number: MMSZ4689-TP; Stock 1: 294852; Pricing 1: 1=0.22, 10=0.203, 25=0.146, 100=0.1136, 250=0.0714, 500=0.0608, 1000=0.0414 (USD); Mount: Surface Mount; Number of Pins: 2; Min Operating Temperature: -55°C; Max Operating Temperature: 150°C; Package Quantity: 3000; Packaging: Tape and Reel; Zener Voltage: 5.1V; Max Power Dissipation: 500mW; Voltage Tolerance: 5%; Power Dissipation: 500mW; Zener Current: 50uA; Lead Free: Lead Free; Supplier Part Number 1: MMSZ4689-TPMSCT-ND
LED1 = 150060VS75000: as LED4 on sheet BMS_rev2; Supplier 1: Digi-Key; Manufacturer Part Number: 150060VS75000; Stock 1: 219425; Pricing 1: 1=0.14, 50=0.129, 100=0.11, 500=0.095 (USD); Mount: Surface Mount; Case/Package: 0603; Number of Pins: 2; Colour: Green; Case Code (Metric): 1608; Case Code (Imperial): 0603; Min Operating Temperature: -40°C; Max Operating Temperature: 85°C; Package Quantity: 1; Packaging: Tape and Reel; Dominant Wavelength: 570nm; Length: 1.6mm; Height: 0.7mm; Width: 0.8mm; REACH SVHC: Unknown; ComponentLink1URL: http://www.farnell.com/datasheets/1911347.pdf; ComponentLink1Description: http://www.farnell.com/datasheets/1911347.pdf; ComponentLink2URL: https://katalog.we-online.de/led/datasheet/150060VS75000.pdf; ComponentLink2Description: https://katalog.we-online.de/led/datasheet/150060VS75000.pdf; ComponentLink3URL: https://www.distrelec.biz/Web/Downloads/_t/ds/150060VS75000_eng_tds.pdf?mime=application%2Fpdf; ComponentLink3Description: https://www.distrelec.biz/Web/Downloads/_t/ds/150060VS75000_eng_tds.pdf?mime=application%2Fpdf; ComponentLink4URL: http://www.produktinfo.conrad.com/datenblaetter/750000-774999/759431-da-01-en-CHIPLED_0603_W_KL_H_GRUEN_150060VS7500.pdf; ComponentLink4Description: http://www.produktinfo.conrad.com/datenblaetter/750000-774999/759431-da-01-en-CHIPLED_0603_W_KL_H_GRUEN_150060VS7500.pdf; Supplier Part Number 1: 732-4980-1-ND
Q1 = 2N7002KT1G: MOSFET N-CH 60V 320MA SOT-23; Manufacturer: ON Semiconductor; Input Capacitance: 24.5pF; Max Power Dissipation: 420mW; Rds On Max: 1.6R; Nominal Vgs: 2.3V; Number of Elements: 1; Power Dissipation: 300mW; Turn-Off Delay Time: 55.8ns; Turn-On Delay Time: 12.2ns; Element Configuration: Single; Gate to Source Voltage (Vgs): 20V; Rise Time: 9ns; Supplier 1: Digi-Key; Manufacturer Part Number: 2N7002KT1G; Stock 1: 39226; Pricing 1: 1=0.21, 10=0.193, 100=0.1264, 500=0.0618, 1000=0.0421 (USD); Case/Package: SOT-23-3; Number of Pins: 3; Contact Plating: Matte,Tin; Min Operating Temperature: -55°C; Max Operating Temperature: 150°C; Packaging: Tape and Reel; Continuous Drain Current (ID): 320mA; Package Quantity: 1; Drain to Source Breakdown Voltage: 60V; Drain to Source Resistance: 1.6R; Threshold Voltage: 2.3V; On-State Resistance: 1.6R; Fall Time: 9ns; Length: 3.04mm; Height: 1.01mm; Width: 1.4mm; Radiation Hardening: No; REACH SVHC: No SVHC; Lead Free: Lead Free; Halogen Free: Halogen Free; ComponentLink1URL: http://www.mouser.com/ds/2/308/2N7002K-D-40616.pdf; ComponentLink1Description: http://www.mouser.com/ds/2/308/2N7002K-D-40616.pdf; ComponentLink2URL: http://www.farnell.com/datasheets/2354033.pdf; ComponentLink2Description: http://www.farnell.com/datasheets/2354033.pdf; ComponentLink3URL: http://www.onsemi.ru.com/pub/Collateral/2N7002K-D.PDF; ComponentLink3Description: http://www.onsemi.ru.com/pub/Collateral/2N7002K-D.PDF; ComponentLink4URL: https://www.verical.com/server-webapp/html/getDatasheet?partID=309924; ComponentLink4Description: https://www.verical.com/server-webapp/html/getDatasheet?partID=309924; ComponentLink5URL: http://www.onsemi.com/pub_link/Collateral/2N7002K-D.PDF; ComponentLink5Description: http://www.onsemi.com/pub_link/Collateral/2N7002K-D.PDF; ComponentLink6URL: http://uk.rs-online.com/webdocs/13e9/0900766b813e9f06.pdf; ComponentLink6Description: http://uk.rs-online.com/webdocs/13e9/0900766b813e9f06.pdf; ComponentLink7URL: http://www.onsemi.com/pub/Collateral/2N7002K-D.PDF; ComponentLink7Description: http://www.onsemi.com/pub/Collateral/2N7002K-D.PDF; Supplier Part Number 1: 2N7002KT1GOSCT-ND
R1 R2 = CRCW06031K00FKEA: as R38 on sheet BMS_rev2; Supplier 1: Digi-Key; Manufacturer Part Number: CRCW06031K00FKEA; Stock 1: 3823619; Pricing 1: 1=0.1, 10=0.042, 100=0.017, 1000=0.0076, 2500=0.0066 (USD); Mount: Surface Mount; Case/Package: 0603; Number of Pins: 2; Weight: 7.1E-05oz; Case Code (Metric): 1608; Case Code (Imperial): 0603; Contact Plating: Tin; Min Operating Temperature: -55°C; Max Operating Temperature: 155°C; Composition: Thick Film; Tolerance: 1%; Packaging: Tape and Reel; Package Quantity: 10; Number of Terminations: 2; Termination: SMD/SMT; Military Standard: Not; Max Power Dissipation: 100mW; Voltage Rating (DC): 75V; Features: Automotive AEC-Q200; Length: 1.55mm; Height: 0.45mm; Width: 0.033inch; Depth: 0.85mm; Radiation Hardening: No; REACH SVHC: Unknown; Lead Free: Lead Free; Supplier Part Number 1: 541-1.00KHCT-ND
R3 = RMCF2512FT75R0: RES 75 OHM 1% 1W 2512; Manufacturer: Stackpole Electronics; Temperature Coefficient: 100ppm/°C; Supplier 1: Digi-Key; Manufacturer Part Number: RMCF2512FT75R0; Stock 1: 8250; Pricing 1: 1=0.39, 10=0.333, 100=0.1301, 1000=0.0545 (USD); Mount: Surface Mount; Case/Package: 2512; Contact Plating: Matte,Tin; Min Operating Temperature: -55°C; Max Operating Temperature: 155°C; Packaging: Tape and Reel; Resistance: 75R; Tolerance: 1%; Power Rating: 1W; Composition: Thick Film; Package Quantity: 4000; Number of Terminations: 2; Max Power Dissipation: 1W; Features: Automotive AEC-Q200; Length: 0.248inch; Height: 0.028inch; Width: 0.126inch; Radiation Hardening: No; Supplier Part Number 1: RMCF2512FT75R0CT-ND
R4 = CRCW06032K00FKEA: RES SMD 2K OHM 1% 1/10W 0603; Manufacturer: Vishay; Power Rating: 100mW; Resistance: 2kR; Voltage Rating: 75V; Temperature Coefficient: 100ppm/°C; Supplier 1: Digi-Key; Manufacturer Part Number: CRCW06032K00FKEA; Stock 1: 388348; Pricing 1: 1=0.1, 10=0.042, 100=0.017, 1000=0.0076, 2500=0.0066 (USD); Mount: Surface Mount; Case/Package: 0603; Number of Pins: 2; Weight: 7.1E-05oz; Case Code (Imperial): 0603; Case Code (Metric): 1608; Contact Plating: Lead,Tin; Min Operating Temperature: -55°C; Max Operating Temperature: 155°C; Tolerance: 1%; Packaging: Tape and Reel; Composition: Thick Film; Package Quantity: 10; Military Standard: Not; Termination: Solder; Voltage Rating (DC): 75V; Number of Terminations: 2; Max Power Dissipation: 100mW; Features: Automotive AEC-Q200; Length: 1.55mm; Height: 0.45mm; Width: 0.85mm; Depth: 0.85mm; Radiation Hardening: No; REACH SVHC: Unknown; Lead Free: Lead Free; Supplier Part Number 1: 541-2.00KHCT-ND
R5 = ERJ-3EKF1003V: as R34 on sheet BMS_rev2; Supplier 1: Digi-Key; Stock 1: 10349154; Pricing 1: 1=0.1, 10=0.064, 100=0.0261, 1000=0.0117, 2500=0.0102 (USD); Case/Package: 0603; Number of Pins: 2; Case Code (Metric): 1608; Case Code (Imperial): 0603; Contact Plating: Tin; Min Operating Temperature: -55°C; Max Operating Temperature: 155°C; Tolerance: 1%; Packaging: Tape and Reel; Composition: Thick Film; Military Standard: Not; Voltage Rating (DC): 75V; Length: 1.6mm; Depth: 0.8mm; Width: 800um; Radiation Hardening: No; REACH SVHC: No SVHC; Lead Free: Lead Free; Supplier Part Number 1: P100KHCT-ND

## Sheet DAISY_CHAINING.SchDoc
size A4
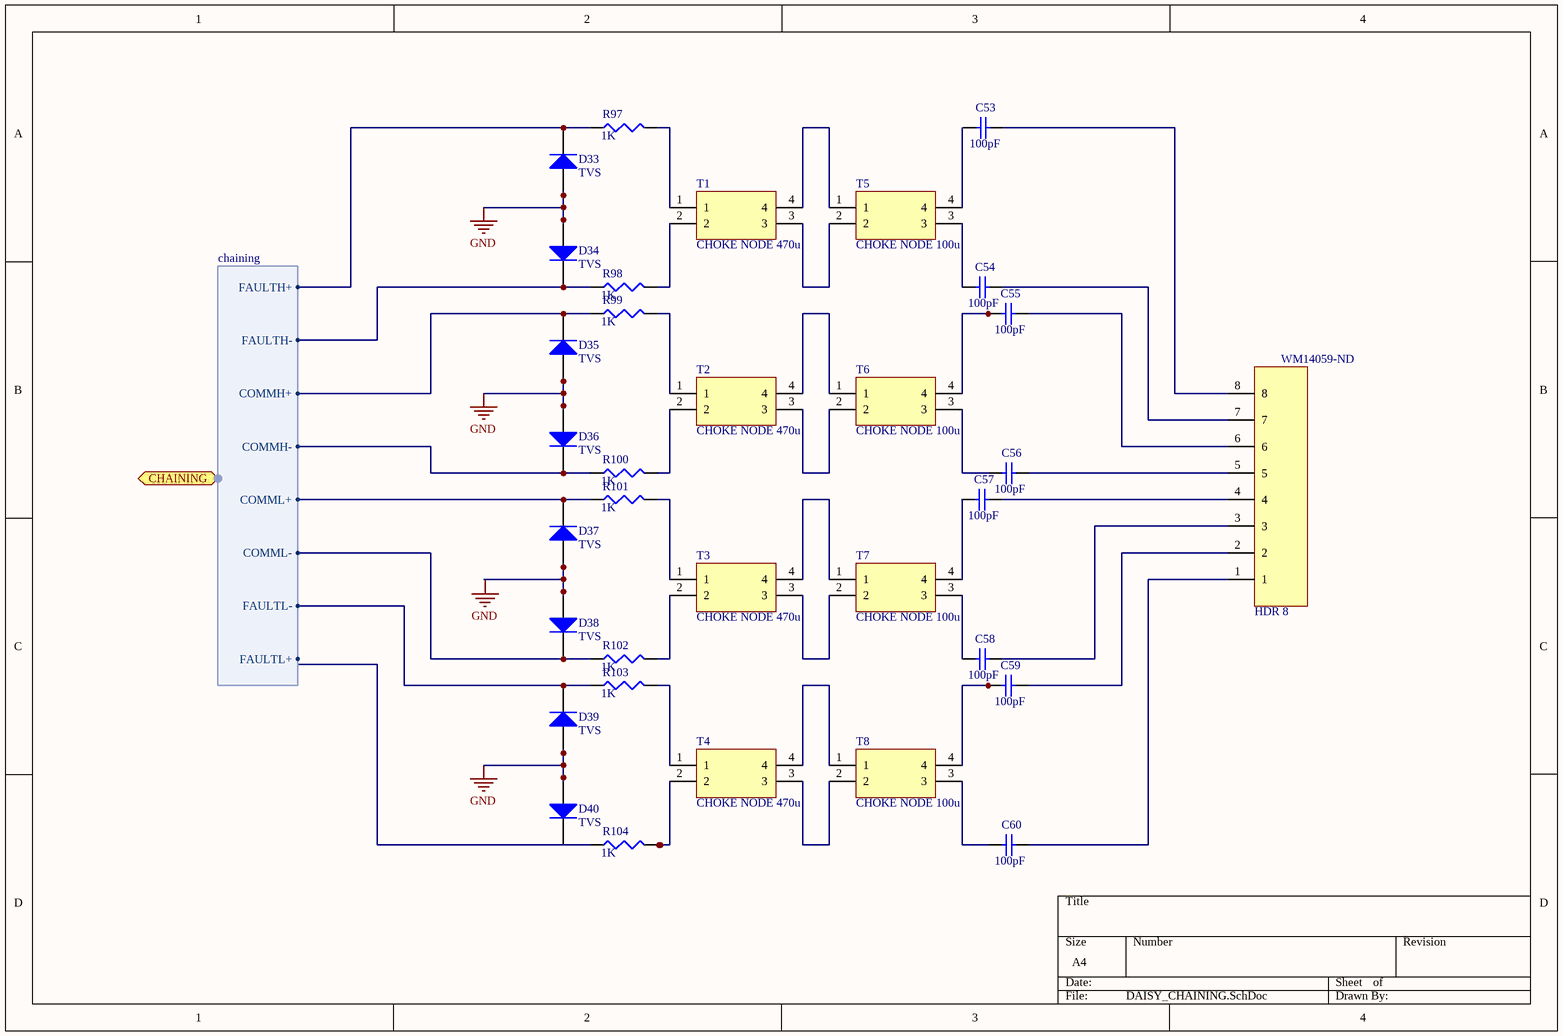
[diagram p4: DAISY_CHAINING.SchDoc]

### Parts
?  HDR 8  Supplier Part Number 1: WM14059-ND  [COMM HDR]
C53  value 100pF  [C1206]  (hidden comment: Cap Semi)
C54  value 100pF  [C1206]  (hidden comment: Cap Semi)
C55  value 100pF  [C1206]  (hidden comment: Cap Semi)
C56  value 100pF  [C1206]  (hidden comment: Cap Semi)
C57  value 100pF  [C1206]  (hidden comment: Cap Semi)
C58  value 100pF  [C1206]  (hidden comment: Cap Semi)
C59  value 100pF  [C1206]  (hidden comment: Cap Semi)
C60  value 100pF  [C1206]  (hidden comment: Cap Semi)
D33  TVS  [TVS DIODE]
D34  TVS  [TVS DIODE]
D35  TVS  [TVS DIODE]
D36  TVS  [TVS DIODE]
D37  TVS  [TVS DIODE]
D38  TVS  [TVS DIODE]
D39  TVS  [TVS DIODE]
D40  TVS  [TVS DIODE]
R97  value 1K  [J1-0603]  (hidden comment: Res3)
R98  value 1K  [J1-0603]  (hidden comment: Res3)
R99  value 1K  [J1-0603]  (hidden comment: Res3)
R100  value 1K  [J1-0603]  (hidden comment: Res3)
R101  value 1K  [J1-0603]  (hidden comment: Res3)
R102  value 1K  [J1-0603]  (hidden comment: Res3)
R103  value 1K  [J1-0603]  (hidden comment: Res3)
R104  value 1K  [J1-0603]  (hidden comment: Res3)
T1  CHOKE NODE 470u  [732-1686-1-ND]
T2  CHOKE NODE 470u  [732-1686-1-ND]
T3  CHOKE NODE 470u  [732-1686-1-ND]
T4  CHOKE NODE 470u  [732-1686-1-ND]
T5  CHOKE NODE 100u  [445-3959-1-ND]
T6  CHOKE NODE 100u  [445-3959-1-ND]
T7  CHOKE NODE 100u  [445-3959-1-ND]
T8  CHOKE NODE 100u  [445-3959-1-ND]

### Ports
CHAINING (harness chaining)

### Harnesses
chaining: FAULTH+, FAULTH-, COMMH+, COMMH-, COMML-, COMML+, FAULTL-, FAULTL+

### Nets
GND: D33.1(A) D34.1(A) D35.1(A) D36.1(A) D39.1(A) D40.1(A)
COMMH+: D35.2(K) R99.1 ; port CHAINING.COMMH+
COMMH-: D36.2(K) R100.1 ; port CHAINING.COMMH-
COMML+: D37.2(K) R101.1 ; port CHAINING.COMML+
COMML-: D38.2(K) R102.1 ; port CHAINING.COMML-
FAULTH+: D33.2(K) R97.1 ; port CHAINING.FAULTH+
FAULTH-: D34.2(K) R98.1 ; port CHAINING.FAULTH-
FAULTL-: D39.2(K) R103.1 ; port CHAINING.FAULTL-
Net?_1: ?.1 C60.2
Net?_2: ?.2 C59.2
Net?_3: ?.3 C58.2
Net?_4: ?.4 C57.2
Net?_5: ?.5 C56.2
Net?_6: ?.6 C55.2
Net?_7: ?.7 C54.2
Net?_8: ?.8 C53.2
NetC54_1: C54.1 T5.3
NetC55_1: C55.1 T6.4
NetC56_1: C56.1 T6.3
NetC57_1: C57.1 T7.4
NetC58_1: C58.1 T7.3
NetC59_1: C59.1 T8.4
NetC60_1: C60.1 T8.3
NetD37_1: D37.1(A) D38.1(A)
NetD40_2: D40.2(K) R104.1
NetR97_2: R97.2 T1.1
NetR98_2: R98.2 T1.2
NetR99_2: R99.2 T2.1
NetR100_2: R100.2 T2.2
NetR101_2: R101.2 T3.1
NetR102_2: R102.2 T3.2
NetR103_2: R103.2 T4.1
NetR104_2: R104.2 T4.2
NetT1_3: T1.3 T5.2
NetT1_4: T1.4 T5.1
NetT2_3: T2.3 T6.2
NetT2_4: T2.4 T6.1
NetT3_3: T3.3 T7.2
NetT3_4: T3.4 T7.1
NetT4_3: T4.3 T8.2
NetT4_4: T4.4 T8.1

Not connected (* = marked no-connect by the designer): C53 1; T5 4

### Notes on the sheet
- Labels drawn without touching a wire or pin: GND

### Library data of the parts
? = HDR 8: Manufacturer: Molex; Manufacturer Part Number: 0705510038; Contact Resistance: 15mR; Number of Positions: 4; Connector Type: Male Pin; Pitch: 2.54mm; Supplier 1: Digi-Key; Stock 1: 677; Pricing 1: 1=1.84, 10=1.666, 100=1.428, 500=1.19, 1000=1.02, 5000=0.9044, 10000=0.884 (USD); Mount: Through Hole; Contact Plating: Gold; Contact Material: Copper Alloy; Housing Colour: Black; Housing Material: Polyester; Colour: Black; Min Operating Temperature: -40°C; Max Operating Temperature: 105°C; Package Quantity: 1520; Number of Rows: 1; Packaging: Rail/Tube; Termination: Solder; Number of Contacts: 4; Orientation: Right Angle; Fastening Type: Latch; Depth: 13.59mm; Contact Mating Length: 0.24inch
C53-C60 = Cap Semi: Capacitor (Semiconductor SIM Model); Published: 8-Jun-2000; LatestRevisionDate: 29-May-2009; LatestRevisionNote: IPC-7351 Footprint Added.; PackageReference: C1206; Publisher: Altium Limited; PackageDescription: Chip Capacitor
D33-D40 = DIODE: Default Diode; Published: 8-Jun-2000; LatestRevisionDate: 17-Jul-2002; LatestRevisionNote: Re-released for DXP Platform.; PackageVersion: Sep-1996; PackageReference: SMC; Publisher: Altium Limited; PackageDescription: DO-214-AB/SMC; 2 C-Bend Leads; Body 7.9 x 5.9 mm, inc. leads (LxW); Code_JEDEC: DO-214-AB
R97-R104 = Res3: Resistor; Published: 8-Jun-2000; LatestRevisionDate: 29-May-2009; LatestRevisionNote: IPC-7351 Footprint Added.; PackageReference: J1-0603; Publisher: Altium Limited; PackageDescription: Chip Resistor

## Sheet THERMO.SchDoc: BMS
size A4; DrawnBy: Jarod Krane; SheetNumber: 6; SheetTotal: 8
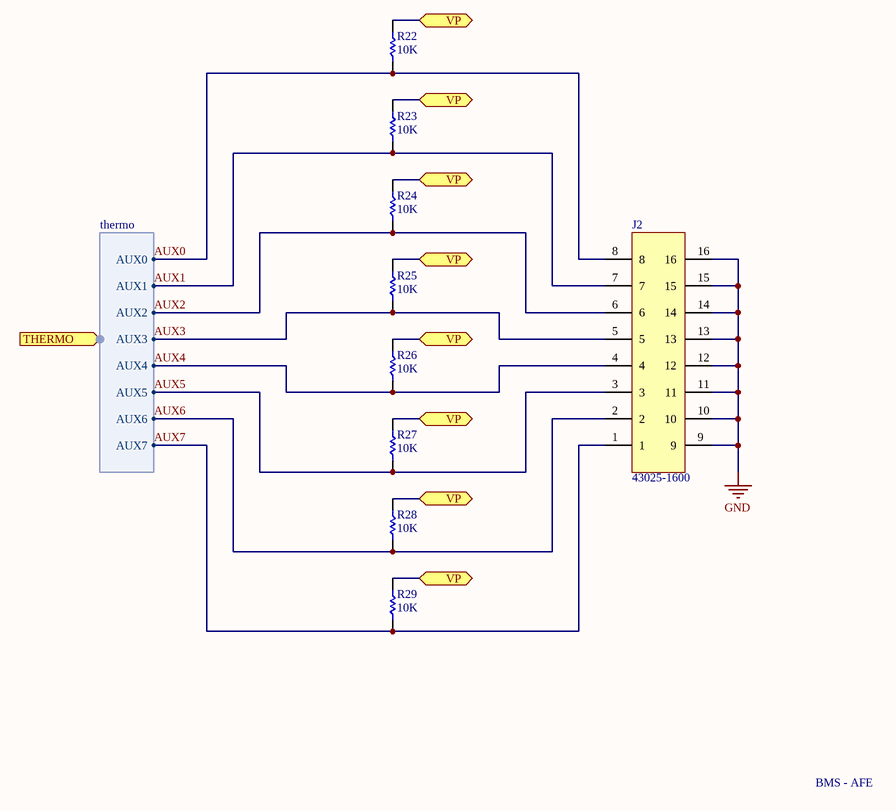
[diagram p5: THERMO.SchDoc]

### Parts
J2  43025-1600  [THERMO HDR]
R22  10K  [0603 RES]
R23  10K  [0603 RES]
R24  10K  [0603 RES]
R25  10K  [0603 RES]
R26  10K  [0603 RES]
R27  10K  [0603 RES]
R28  10K  [0603 RES]
R29  10K  [0603 RES]

### Ports
THERMO (harness thermo), VP

### Harnesses
thermo: AUX0, AUX1, AUX2, AUX3, AUX4, AUX5, AUX6, AUX7

### Nets
GND: J2.9 J2.10 J2.11 J2.12 J2.13 J2.14 J2.15 J2.16
AUX0: J2.8 R22.1 ; port THERMO.AUX0
AUX1: J2.7 R23.1 ; port THERMO.AUX1
AUX2: J2.6 R24.1 ; port THERMO.AUX2
AUX3: J2.5 R25.1 ; port THERMO.AUX3
AUX4: J2.4 R26.1 ; port THERMO.AUX4
AUX5: J2.3 R27.1 ; port THERMO.AUX5
AUX6: J2.2 R28.1 ; port THERMO.AUX6
AUX7: J2.1 R29.1 ; port THERMO.AUX7
VP: R22.2 R23.2 R24.2 R25.2 R26.2 R27.2 R28.2 R29.2 ; port VP

### Notes on the sheet
- BMS - AFE

### Library data of the parts
J2 = 43025-1600: CONN RECEPT 16POS 3MM DUAL ROW; Manufacturer: Molex; Number of Contacts: 16; Max Voltage Rating (DC): 600.6kV; Connector Type: Power,Rectangular,Socket; Max Voltage Rating (AC): 600V; Gender: Female; Current Rating: 5A; Contact Resistance: 10mR; Voltage Rating (AC): 250V; Approvals: CSA,TUV,UL; Glow Wire Compliant: Non-compliant; Supplier 1: Digi-Key; Manufacturer Part Number: 43025-1600; Stock 1: 21915; Pricing 1: 1=0.96, 10=0.843, 25=0.7928, 50=0.76, 100=0.7269, 250=0.6608, 500=0.5947, 1000=0.5286, 2500=0.4791 (USD); Mount: Cable; Colour: Black; Housing Colour: Black; Housing Material: Polyester; Material: Polyester; Min Operating Temperature: -40°C; Max Operating Temperature: 105°C; Orientation: Straight; Number of Rows: 2; Packaging: Bulk; Number of Positions: 16; Termination: Crimp; Package Quantity: 1500; Number of Poles: 16; Number of Circuits: 16; Working Voltage: 250V; Length: 24.85mm; Pitch: 3mm; Row Spacing: 3mm; Depth: 14mm; Width: 11.56mm; Radiation Hardening: No; Flammability Rating: UL94 V-0; REACH SVHC: Unknown; Lead Free: Lead Free; ComponentLink1URL: https://www.alliedelec.com/m/d/7b41ca9c4fb783ac9c05f4e8e707f04e.pdf; ComponentLink1Description: https://www.alliedelec.com/m/d/7b41ca9c4fb783ac9c05f4e8e707f04e.pdf; ComponentLink2URL: http://uk.rs-online.com/webdocs/13c3/0900766b813c3a12.pdf; ComponentLink2Description: http://uk.rs-online.com/webdocs/13c3/0900766b813c3a12.pdf; ComponentLink3URL: https://www.distrelec.biz/Web/Downloads/22/98/04402298.pdf?mime=application%2Fpdf; ComponentLink3Description: https://www.distrelec.biz/Web/Downloads/22/98/04402298.pdf?mime=application%2Fpdf; ComponentLink4URL: http://www.jameco.com/Jameco/Products/ProdDS/883000.pdf; ComponentLink4Description: http://www.jameco.com/Jameco/Products/ProdDS/883000.pdf; ComponentLink5URL: http://www.mouser.com/ds/2/276/0430251600_CRIMP_HOUSINGS-142756.pdf; ComponentLink5Description: http://www.mouser.com/ds/2/276/0430251600_CRIMP_HOUSINGS-142756.pdf; ComponentLink6URL: http://www.molex.com/webdocs/datasheets/pdf/en-us/0430251600_CRIMP_HOUSINGS.pdf; ComponentLink6Description: http://www.molex.com/webdocs/datasheets/pdf/en-us/0430251600_CRIMP_HOUSINGS.pdf; Supplier Part Number 1: WM2490-ND
R22-R29 = ERJ-3EKF1002V: RES SMD 10K OHM 1% 1/10W 0603; Manufacturer: Panasonic; Resistance: 10kR; Power Rating: 100mW; Voltage Rating: 75V; Temperature Coefficient: 100ppm/°C; Supplier 1: Digi-Key; Manufacturer Part Number: ERJ-3EKF1002V; Stock 1: 19944837; Pricing 1: 1=0.1, 10=0.064, 100=0.0261, 1000=0.0117, 2500=0.0102 (USD); Mount: Surface Mount; Case/Package: 0603; Number of Pins: 2; Case Code (Metric): 1608; Case Code (Imperial): 0603; Contact Plating: Tin; Min Operating Temperature: -55°C; Max Operating Temperature: 155°C; Tolerance: 1%; Packaging: Tape and Reel; Composition: Thick Film; Military Standard: Not; Voltage Rating (DC): 75V; Package Quantity: 1; Number of Terminations: 2; Termination: SMD/SMT; Max Power Dissipation: 100mW; Features: Automotive AEC-Q200; Length: 1.6mm; Height: 0.45mm; Width: 0.031inch; Depth: 0.8mm; Radiation Hardening: No; REACH SVHC: No SVHC; Lead Free: Lead Free; Supplier Part Number 1: P10.0KHDKR-ND